# Altium schematic sheet MCU.SchDoc
size A
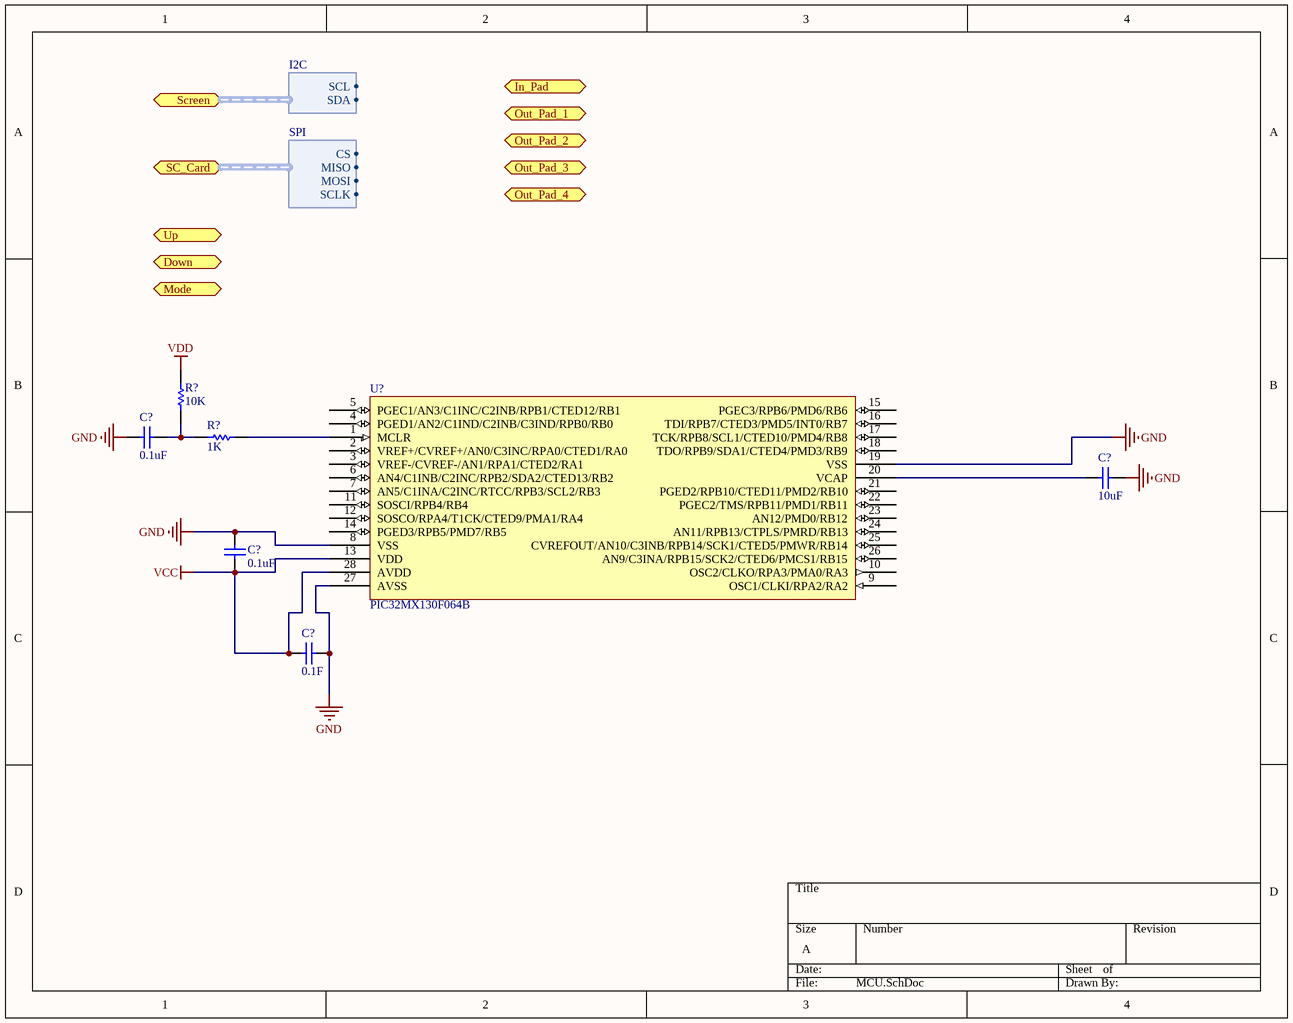
[diagram p0: MCU.SchDoc]

## Parts
(Parts that share a designator on the sheet are numbered #1, #2 ... from top to bottom, then left to right.)
C?#1  0.1uF  [RAD-0.3]
C?#2  10uF  [RAD-0.3]
C?#3  0.1uF  [RAD-0.3]
C?#4  0.1F  [RAD-0.3]
R?#1  10K  [AXIAL-0.3]
R?#2  1K  [AXIAL-0.3]
U?  PIC32MX130F064B

## Ports
Down (in), In_Pad (bidir), Mode (in), Out_Pad_1 (bidir), Out_Pad_2 (bidir), Out_Pad_3 (bidir), Out_Pad_4 (bidir), SC_Card (harness SPI), Screen (harness I2C), Up (in)

## Harnesses
I2C: SCL, SDA
SPI: CS, MISO, MOSI, SCLK

## Nets
GND: C?#1.1 C?#2.2 C?#3.2 C?#4.2 U?.8(VSS) U?.19(VSS) U?.27(AVSS)
VCC: C?#3.1 C?#4.1 U?.13(VDD) U?.28(AVDD)
VDD: R?#1.2
NetC?#1_2: C?#1.2 R?#1.1 R?#2.1
NetC?#2_1: C?#2.1 U?.20(VCAP)
NetR?#2_2: R?#2.2 U?.1(MCLR)

Not connected (* = marked no-connect by the designer): U? 2(VREF+/CVREF+/AN0/C3INC/RPA0/CTED1/RA0) 3(VREF-/CVREF-/AN1/RPA1/CTED2/RA1) 4(PGED1/AN2/C1IND/C2INB/C3IND/RPB0/RB0) 5(PGEC1/AN3/C1INC/C2INB/RPB1/CTED12/RB1) 6(AN4/C1INB/C2INC/RPB2/SDA2/CTED13/RB2) 7(AN5/C1INA/C2INC/RTCC/RPB3/SCL2/RB3) 9(OSC1/CLKI/RPA2/RA2) 10(OSC2/CLKO/RPA3/PMA0/RA3) 11(SOSCI/RPB4/RB4) 12(SOSCO/RPA4/T1CK/CTED9/PMA1/RA4) 14(PGED3/RPB5/PMD7/RB5) 15(PGEC3/RPB6/PMD6/RB6) 16(TDI/RPB7/CTED3/PMD5/INT0/RB7) 17(TCK/RPB8/SCL1/CTED10/PMD4/RB8) 18(TDO/RPB9/SDA1/CTED4/PMD3/RB9) 21(PGED2/RPB10/CTED11/PMD2/RB10) 22(PGEC2/TMS/RPB11/PMD1/RB11) 23(AN12/PMD0/RB12) 24(AN11/RPB13/CTPLS/PMRD/RB13) 25(CVREFOUT/AN10/C3INB/RPB14/SCK1/CTED5/PMWR/RB14) 26(AN9/C3INA/RPB15/SCK2/CTED6/PMCS1/RB15)

## Library data of the parts
C?#1-C?#4 = Cap: Capacitor; Published: 8-Jun-2000; LatestRevisionDate: 17-Jul-2002; LatestRevisionNote: Re-released for DXP Platform.; PackageReference: RAD-0.3; Publisher: Altium Limited; PackageDescription: Radial Cap, Thru-Hole; 2 Leads; 0.3 in Pin Spacing
  C?#1 C?#3: Value: 0.1uF
  C?#2: Value: 10uF
  C?#4: Value: 0.1F
R?#1 R?#2 = Res1: Resistor; Published: 8-Jun-2000; LatestRevisionDate: 17-Jul-2002; LatestRevisionNote: Re-released for DXP Platform.; PackageReference: AXIAL-0.3; Publisher: Altium Limited; PackageDescription: Axial Device, Thru-Hole; 2 Leads; 0.3 in Pin Spacing
  R?#1: Value: 10K
  R?#2: Value: 1K
U? = PIC32MX130F064B: Producer: Microchip; ProducerRef: PIC32MX130F064B-I/SP; Supplier: Farnell; SupplierRef: 2097776